# EAGLE design mood-badge (EAGLE 9.6.2)
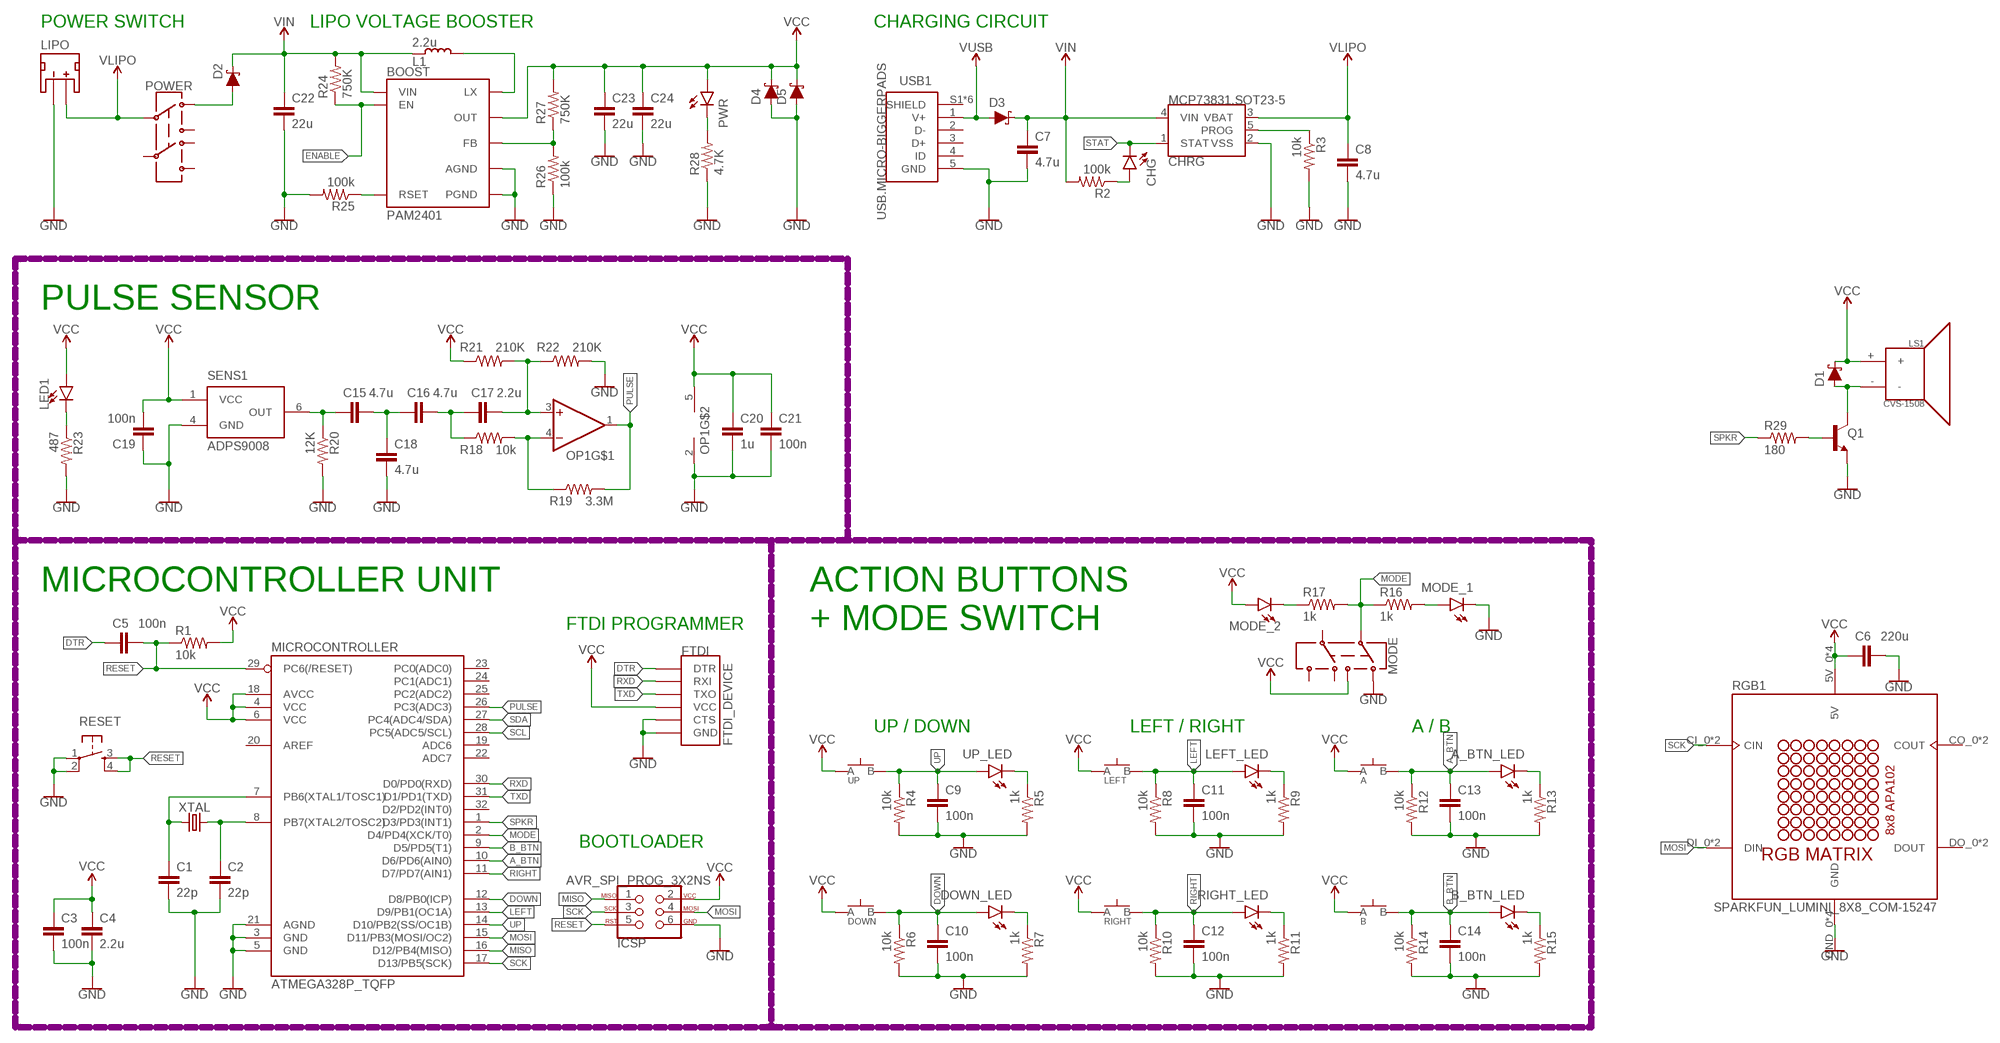
[diagram p0: schematic, sheet 1]

## Parts
A  SPST.KT11P4SM34LFS  [SPST.KT11P4SM34LFS]
A_BTN_LED  LED0603  [LED-0603]
B  SPST.KT11P4SM34LFS  [SPST.KT11P4SM34LFS]
B_BTN_LED  LED0603  [LED-0603]
BOOST  PAM2401  [MSOP8]
C1  22p  CAPACITOR0603  [C0603]
C2  22p  CAPACITOR0603  [C0603]
C3  100n  CAPACITOR0603  [C0603]
C4  2.2u  CAPACITOR0603  [C0603]
C5  100n  CAPACITOR0603  [C0603]
C6  220u  CAPACITOR1206  [C1206]
C7  4.7u  CAPACITOR0603  [C0603]
C8  4.7u  CAPACITOR0603  [C0603]
C9  100n  CAPACITOR0603  [C0603]
C10  100n  CAPACITOR0603  [C0603]
C11  100n  CAPACITOR0603  [C0603]
C12  100n  CAPACITOR0603  [C0603]
C13  100n  CAPACITOR0603  [C0603]
C14  100n  CAPACITOR0603  [C0603]
C15  4.7u  CAPACITOR0603  [C0603]
C16  4.7u  CAPACITOR0603  [C0603]
C17  2.2u  CAPACITOR0603  [C0603]
C18  4.7u  CAPACITOR0603  [C0603]
C19  100n  CAPACITOR0603  [C0603]
C20  1u  CAPACITOR0603  [C0603]
C21  100n  CAPACITOR0603  [C0603]
C22  22u  CAPACITOR0603  [C0603]
C23  22u  CAPACITOR0603  [C0603]
C24  22u  CAPACITOR0603  [C0603]
CHG  LED0603  [LED-0603]
CHRG  MCP73831.SOT23-5  [SOT23-5]
D1  SCHOTTKY-USC  [USC]
D2  SCHOTTKY-USC  [USC]
D3  SCHOTTKY-USC  [USC]
D4  SCHOTTKY-USC  [USC]
D5  SCHOTTKY-USC  [USC]
DOWN  SPST.KT11P4SM34LFS  [SPST.KT11P4SM34LFS]
DOWN_LED  LED0603  [LED-0603]
FTDI  FTDI_DEVICE  [FTDI_DEVICE]
ICSP  AVR_SPI_PROG_3X2NS  [2X3-NS]
L1  2.2u  INDUCTOR0603  [L0603]
LED1  LEDZ-BEND  [2-SMD.Z-BEND]
LEFT  SPST.KT11P4SM34LFS  [SPST.KT11P4SM34LFS]
LEFT_LED  LED0603  [LED-0603]
LIPO  JST_2MM_MALE  [JST-2-SMD]
LS1  CVS-1508  SPEAKERCVS-1508  [CVS-1508_PCBSPKR]
MICROCONTROLLER  ATMEGA328P_TQFP  [TQFP32-08]
MODE  SWITCH.JS202011JXQNUPWARDS  [SWITCH.00]
MODE_1  LED0603  [LED-0603]
MODE_2  LED0603  [LED-0603]
OP1  OP-SINGLEOT  [SOT23-5]
POWER  SWITCH.JS202011JXQNUPWARDS  [SWITCH.00]
PWR  LED0603  [LED-0603]
Q1  NPN-GENERIC  [SOT23-3]
R1  10k  RESISTOR0603  [R0603]
R2  100k  RESISTOR0603  [R0603]
R3  10k  RESISTOR0603  [R0603]
R4  10k  RESISTOR0603  [R0603]
R5  1k  RESISTOR0603  [R0603]
R6  10k  RESISTOR0603  [R0603]
R7  1k  RESISTOR0603  [R0603]
R8  10k  RESISTOR0603  [R0603]
R9  1k  RESISTOR0603  [R0603]
R10  10k  RESISTOR0603  [R0603]
R11  1k  RESISTOR0603  [R0603]
R12  10k  RESISTOR0603  [R0603]
R13  1k  RESISTOR0603  [R0603]
R14  10k  RESISTOR0603  [R0603]
R15  1k  RESISTOR0603  [R0603]
R16  1k  RESISTOR0603  [R0603]
R17  1k  RESISTOR0603  [R0603]
R18  10k  RESISTOR0603  [R0603]
R19  3.3M  RESISTOR0603  [R0603]
R20  12K  RESISTOR0603  [R0603]
R21  210K  RESISTOR0603  [R0603]
R22  210K  RESISTOR0603  [R0603]
R23  487  RESISTOR0603  [R0603]
R24  750K  RESISTOR0603  [R0603]
R25  100k  RESISTOR0603  [R0603]
R26  100k  RESISTOR0603  [R0603]
R27  750K  RESISTOR0603  [R0603]
R28  4.7K  RESISTOR0603  [R0603]
R29  180  RESISTOR0603  [R0603]
RESET  SPST-PTS830GG140  [BUTTON-GULLWING]
RGB1  SPARKFUN_LUMINI_8X8_COM-15247  [SPARKFUN_LUMINI_8X8_COM-15047]
RIGHT  SPST.KT11P4SM34LFS  [SPST.KT11P4SM34LFS]
RIGHT_LED  LED0603  [LED-0603]
SENS1  ADPS9008  [6-PIN.CHIPLED]
UP  SPST.KT11P4SM34LFS  [SPST.KT11P4SM34LFS]
UP_LED  LED0603  [LED-0603]
USB1  USB.MICRO-BIGGERPADS  [USB-MICRO-01.BIGGERPADS]
XTAL  CRYSTAL-CA-310  [CA-301]

## Nets
A_BTN: A.3(B) A.4(B) A_BTN_LED.A C13.1 MICROCONTROLLER.10(D6/PD6(AIN0)) R12.1
B_BTN: B.3(B) B.4(B) B_BTN_LED.A C14.1 MICROCONTROLLER.9(D5/PD5(T1)) R14.1
DOWN: C10.1 DOWN.3(B) DOWN.4(B) DOWN_LED.A MICROCONTROLLER.12(D8/PB0(ICP)) R6.1
DTR: C5.1 FTDI.DTR
ENABLE: BOOST.2(EN) R24.1
GND: BOOST.4(AGND) BOOST.8(PGND) C1.2 C2.2 C3.2 C4.2 C6.2 C7.2 C8.2 C9.2 C10.2 C11.2 C12.2 C13.2 C14.2 C18.2 C19.1 C20.2 C21.2 C22.2 C23.2 C24.2 CHRG.2(VSS) D4.+(A) D5.+(A) FTDI.CTS FTDI.GND ICSP.6 LIPO.1(-) MICROCONTROLLER.3(GND) MICROCONTROLLER.5(GND) MICROCONTROLLER.21(AGND) MODE.1 MODE_1.C OP1.2(V-) Q1.2(E) R3.2 R4.2 R5.2 R6.2 R7.2 R8.2 R9.2 R10.2 R11.2 R12.2 R13.2 R14.2 R15.2 R20.2 R22.2 R23.2 R25.2 R26.1 R28.1 RESET.1 RESET.2 RGB1.GND_0(GND) RGB1.GND_1(GND) RGB1.GND_2(GND) RGB1.GND_3(GND) SENS1.4(GND) USB1.5(GND)
LEFT: C11.1 LEFT.3(B) LEFT.4(B) LEFT_LED.A MICROCONTROLLER.13(D9/PB1(OC1A)) R8.1
MISO: ICSP.1 MICROCONTROLLER.16(D12/PB4(MISO))
MODE: MICROCONTROLLER.2(D4/PD4(XCK/T0)) MODE.2 R16.1 R17.2
MOSI: ICSP.4 MICROCONTROLLER.15(D11/PB3(MOSI/OC2)) RGB1.DI_0(DIN) RGB1.DI_1(DIN)
N$1: C1.1 MICROCONTROLLER.7(PB6(XTAL1/TOSC1)) XTAL.1
N$2: C2.1 MICROCONTROLLER.8(PB7(XTAL2/TOSC2)) XTAL.2
N$3: CHG.A R2.1
N$4: D2.+(A) POWER.1
N$5: D1.+(A) LS1.- Q1.3(C)
N$7: CHRG.5(PROG) R3.1
N$8: MODE_1.A R16.2
N$9: R5.1 UP_LED.C
N$11: DOWN_LED.C R7.1
N$13: LEFT_LED.C R9.1
N$15: R11.1 RIGHT_LED.C
N$17: A_BTN_LED.C R13.1
N$19: B_BTN_LED.C R15.1
N$20: C15.1 R20.1 SENS1.6(OUT)
N$21: MODE_2.C R17.1
N$23: C15.2 C16.1 C18.1
N$24: C16.2 C17.1 R18.1
N$25: C17.2 OP1.3(+IN) R21.2 R22.1
N$26: OP1.4(-IN) R18.2 R19.1
N$27: BOOST.6(RSET) R25.1
N$28: LED1.-(C) R23.1
N$29: BOOST.1(LX) L1.2
N$30: BOOST.5(FB) R26.2 R27.1
N$31: Q1.1(B) R29.2
N$32: PWR.C R28.2
PULSE: MICROCONTROLLER.26(PC3(ADC3)) OP1.1(OUT) R19.2
RESET: C5.2 ICSP.5 MICROCONTROLLER.29(PC6(/RESET)) R1.1 RESET.3 RESET.4
RIGHT: C12.1 MICROCONTROLLER.11(D7/PD7(AIN1)) R10.1 RIGHT.3(B) RIGHT.4(B) RIGHT_LED.A
RXD: FTDI.TXO(RXI) MICROCONTROLLER.30(D0/PD0(RXD))
SCK: ICSP.3 MICROCONTROLLER.17(D13/PB5(SCK)) RGB1.CI_0(CIN) RGB1.CI_1(CIN)
SCL: MICROCONTROLLER.28(PC5(ADC5/SCL))
SDA: MICROCONTROLLER.27(PC4(ADC4/SDA))
SPKR: MICROCONTROLLER.1(D3/PD3(INT1)) R29.1
STAT: CHG.C CHRG.1(STAT)
TXD: FTDI.RXI(TXO) MICROCONTROLLER.31(D1/PD1(TXD))
UP: C9.1 MICROCONTROLLER.14(D10/PB2(SS/OC1B)) R4.1 UP.3(B) UP.4(B) UP_LED.A
V_USB: D3.+(A) USB1.1(V+) ; supply symbol labelled VUSB
VCC: A.1(A) A.2(A) B.1(A) B.2(A) BOOST.7(OUT) C3.1 C4.1 C6.1 C19.2 C20.1 C21.1 C23.1 C24.1 D1.-(C) D4.-(C) D5.-(C) DOWN.1(A) DOWN.2(A) FTDI.VCC ICSP.2 LED1.+(A) LEFT.1(A) LEFT.2(A) LS1.+ MICROCONTROLLER.4(VCC) MICROCONTROLLER.6(VCC) MICROCONTROLLER.18(AVCC) MODE.3 MODE_2.A OP1.5(V+) PWR.A R1.2 R21.1 R27.2 RGB1.5V_0(5V) RGB1.5V_1(5V) RGB1.5V_2(5V) RGB1.5V_3(5V) RIGHT.1(A) RIGHT.2(A) SENS1.1(VCC) UP.1(A) UP.2(A)
VIN: BOOST.3(VIN) C7.1 C22.1 CHRG.4(VIN) D2.-(C) D3.-(C) L1.1 R2.2 R24.2
VLIPO: C8.1 CHRG.3(VBAT) LIPO.2(+) POWER.2
Unconnected: LIPO.NC1(PAD1) LIPO.NC2(PAD2) MICROCONTROLLER.19(ADC6) MICROCONTROLLER.20(AREF) MICROCONTROLLER.22(ADC7) MICROCONTROLLER.23(PC0(ADC0)) MICROCONTROLLER.24(PC1(ADC1)) MICROCONTROLLER.25(PC2(ADC2)) MICROCONTROLLER.32(D2/PD2(INT0)) MODE.5 MODE.6 MODE.7 POWER.3 POWER.5 POWER.6 POWER.7 RGB1.CO_0(COUT) RGB1.CO_1(COUT) RGB1.DO_0(DOUT) RGB1.DO_1(DOUT) USB1.2(D-) USB1.3(D+) USB1.4(ID) USB1.S1(SHIELD) USB1.S2(SHIELD) USB1.S3(SHIELD) USB1.S4(SHIELD) USB1.S5(SHIELD) USB1.S6(SHIELD)

## Notes on the sheet
- POWER SWITCH | LIPO VOLTAGE BOOSTER | CHARGING CIRCUIT
- PULSE SENSOR
- ACTION BUTTONS
  + MODE SWITCH
- MICROCONTROLLER UNIT
- FTDI PROGRAMMER
- UP / DOWN | LEFT / RIGHT | A / B
- BOOTLOADER

## Library data of the parts
A B DOWN LEFT RIGHT UP = LinnesLab-Switches:SPST.KT11P4SM34LFS: https://www.ckswitches.com/media/1468/kt.pdf
A_BTN_LED B_BTN_LED CHG DOWN_LED LED1 LEFT_LED MODE_1 MODE_2 PWR RIGHT_LED UP_LED = LinnesLab-LED:LED: LED (Generic) Standard schematic elements and footprints for 5mm, 3mm, 1206, and 0603 sized LEDs. Generic LEDs with no color specified. LTST-C190KGKT: arrow indicates cathode
BOOST = SparkFun-IC-Power:PAM2401: PAM2401 - Boost PMIC Specifications: Up to 1A output current 0.9V to 4.75V Input Range 2.5V to 5.0V Adjustable Output Voltage Datasheet <https://www.diodes.com/assets/Datasheets/PAM2401.pdf> (Diodes inc.); PROD_ID: IC-13769
C1-C24 = LinnesLab-Passives:CAPACITOR
CHRG = LinnesLab-Power:MCP73831
D1-D5 = LinnesLab-DiscreteSemi:SCHOTTKY: Schottky diode A Schottky diode is a semiconductor diode which has a low forward voltage drop and a very fast switching action. Example: Digi-Key Part Number: RB161MM-20CT-ND
FTDI = LinnesLab-Connectors:FTDI_DEVICE
ICSP = LinnesLab-Connectors:AVR_SPI_PROG_3X2: AVR ISP 6 Pin This is the reduced ISP connector for AVR programming. Common on Arduino. This footprint will take up less PCB space and can be used with a 10-pin to 6-pin adapter such as SKU: BOB-08508 **Special note about "TEST_POINT" package. The stop mask is on the top side, so if you want your programming test points to be on the bottom of your board, make sure to place this package on the bottom side of the board. This also ensure that the orientation to program from the bottom side will be correct. SparkFun Products: SparkFun ISP Pogo Adapter <https://www.sparkfun.com/products/11591> - NS Tiny AVR Programmer <https://www.sparkfun.com/products/11801> -PTH
L1 = LinnesLab-Passives:INDUCTOR
LIPO = LinnesLab-Connectors:JST_2MM_MALE: JST 2MM MALE RA CONNECTOR Two pin, compact surface mount connector. Commonly used as a battery input connection point. We really like the solid locking feeling and high current rating on these small connectors. We use these all the time as battery connectors. Mates to single-cell LiPo batteries. Here is the connector we sell at SparkFun: JST Right Angle Connector - White <https://www.sparkfun.com/products/8612> (PRT-08612) Datasheet <http://www.sparkfun.com/datasheets/Prototyping/Connectors/JST-Horizontal.pdf> It was used on these SparkFun products: SparkFun MOSFET Power Controller <https://www.sparkfun.com/products/11214> (PRT-11214) SparkFun Battery Babysitter - LiPo Battery Manager <https://www.sparkfun.com/products/13777> (PRT-13777) And many, many others that required a lipo battery connection.; PROD_ID: CONN-11443; SF_ID: PRT-08612
LS1 = SparkFun-Electromechanical:SPEAKER: Speaker Generic 2-terminal loudspeakers SparkFun Products Speaker - PCB Mount <https://www.sparkfun.com/products/11089> (COM-11089); PROD_ID: COM-14823
MICROCONTROLLER = LinnesLab-Microcontrollers:ATMEGA328P_TQFP: Popular 328P in QFP Storefront component: ATmega328 - TQFP <https://www.sparkfun.com/products/13448> (COM-13448) Datasheet <http://www.sparkfun.com/datasheets/Components/SMD/ATMega328.pdf> SparkFun Products SparkFun RedBoard - Programmed with Arduino <https://www.sparkfun.com/products/12757> (DEV-12757) Arduino Pro Mini 328 - 5V/16MHz <https://www.sparkfun.com/products/11113> (DEV-11113) Arduino Pro Mini 328 - 3.3V/8MHz <https://www.sparkfun.com/products/11114> (DEV-11114) SparkFun OpenLog <https://www.sparkfun.com/products/13712> (DEV-13712) SparkFun MicroView - OLED Arduino Module <https://www.sparkfun.com/products/12923> (DEV-12923) SparkFun Digital Sandbox <https://www.sparkfun.com/products/12651> (DEV-12651) SparkFun PicoBoard <https://www.sparkfun.com/products/11888> (WIG-11888) Arduino Fio <https://www.sparkfun.com/products/10116> (DEV-10116) LilyPad Arduino 328 Main Board <https://www.sparkfun.com/products/13342> (DEV-13342) SparkFun RedStick <https://www.sparkfun.com/products/13741> (DEV-13741) LilyPad MP3 <https://www.sparkfun.com/products/11013> (DEV-11013) LilyPad Arduino SimpleSnap <https://www.sparkfun.com/products/10941> (DEV-10941) SparkFun Stepoko <https://www.sparkfun.com/products/13899> (ROB-13899) SparkFun Geiger Counter <https://www.sparkfun.com/products/11345> (SEN-11345) SparkFun EL Sequencer <https://www.sparkfun.com/products/12781> (COM-12781) Arduino Pro 328 - 5V/16MHz <https://www.sparkfun.com/products/10915> (DEV-10915) CryptoCape <https://www.sparkfun.com/products/12773> (DEV-12773) SparkFun IR Thermometer Evaluation Board - MLX90614 <https://www.sparkfun.com/products/10740> (SEN-10740) SparkFun RedBot Mainboard <https://www.sparkfun.com/products/12097> (ROB-12097) Arduino Pro 328 - 3.3V/8MHz <https://www.sparkfun.com/products/10914> (DEV-10914) SparkFun Block for Intel® Edison - Arduino <https://www.sparkfun.com/products/13036> (DEV-13036) SparkFun Simon Says - Surface Mount Soldering Kit <https://www.sparkfun.com/products/10935> (KIT-10935) SparkFun 7-Segment Serial Display - Red <https://www.sparkfun.com/products/11441> (COM-11441) SparkFun 7-Segment Serial Display - White <https://www.sparkfun.com/products/11629> (COM-11629) SparkFun 7-Segment Serial Display - Yellow <https://www.sparkfun.com/products/11443> (COM-11443) SparkFun 7-Segment Serial Display - Kelly Green <https://www.sparkfun.com/products/11440> (COM-11440) SparkFun 7-Segment Serial Display - Blue <https://www.sparkfun.com/products/11442> (COM-11442) SparkFun OpenSegment Serial Display - 20mm (Blue) <https://www.sparkfun.com/products/11647> (COM-11647) SparkFun OpenSegment Serial Display - 20mm (Green) <https://www.sparkfun.com/products/11646> (COM-11646) SparkFun OpenSegment Serial Display - 20mm (White) <https://www.sparkfun.com/products/11648> (COM-11648) SparkFun OpenSegment Serial Display - 20mm (Red) <https://www.sparkfun.com/products/11644> (COM-11644) SparkFun OpenSegment Serial Display - 20mm (Yellow) <https://www.sparkfun.com/products/11645> (COM-11645) SparkFun OpenSegment Shield <https://www.sparkfun.com/products/13190> (DEV-13190); PROD_ID: IC-09069
MODE POWER = LinnesLab-Switches:SWITCH.JS202011JXQN: Manufacturer's Part Numer: JS202011JAQN for right angle throw JS202011JCQN for top side throw
OP1 = LinnesLab-AnalogIC:OP-SINGLE: Single Op Amp 2.7V to 6.0V Single Supply CMOS Source: http://ww1.microchip.com/downloads/en/DeviceDoc/21314g.pdf
Q1 = LinnesLab-DiscreteSemi:NPN
R1-R29 = LinnesLab-Passives:RESISTOR
RESET = LinnesLab-Switches:SPST-PTS830GG140
RGB1 = mood-badge-components:SPARKFUN_LUMINI_8X8_COM-15247: SparkFun LuMini LED Matrix - 8x8 (64 x APA102-2020) https://www.sparkfun.com/products/15047 This is the 8x8 SparkFun LuMini LED Matrix, packed with 64 individually addressable LEDs, each capable of producing 16 million colors, it provides you with a great way to add a square of light to just about anything, or even make a screen of a custom shape! LuMini is a miniaturized version of our Lumenati LED line but instead of utilizing 5mm by 5mm APA102 LEDs (APA102-5050), LuMini uses a 2mm by 2mm package (APA102-2020). This allows for incredibly tight pixel densities, and thus, a screen with less pixelation! The LuMini LED Matrix is powered and controlled using a few solder pads on the back of each board. These pads include 5V and ground, a set of pads for data in and clock input, and another set for data out and clock output. Since the matrix acts like a string of LEDs, the indexing (or numbering) of the LEDs moves from left to right, bottom to top of the board, on the LED facing side. The last handy feature we've equipped the LuMini LED Matrix with is four detachable mounting points that can be used to secure your ring to a surface/project or be broken off to make more complex designs. However if you want to break off the mounting holes from the board, multiple matrices can be soldered together to form a larger display! Note: In larger installations you may need to add a decoupling capacitor between power and ground to prevent voltage dips when turning on a whole bunch of LED’s simultaneously. We recommend using a 4.7µF capacitor which we sell in strips of 10.
SENS1 = LinnesLab-Sensors:ADPS9008
USB1 = LinnesLab-Connectors:USB.MICRO: DigiKey PN: 609-4613-1-ND
XTAL = LinnesLab-Clocks:CRYSTAL-CA-310

## Board
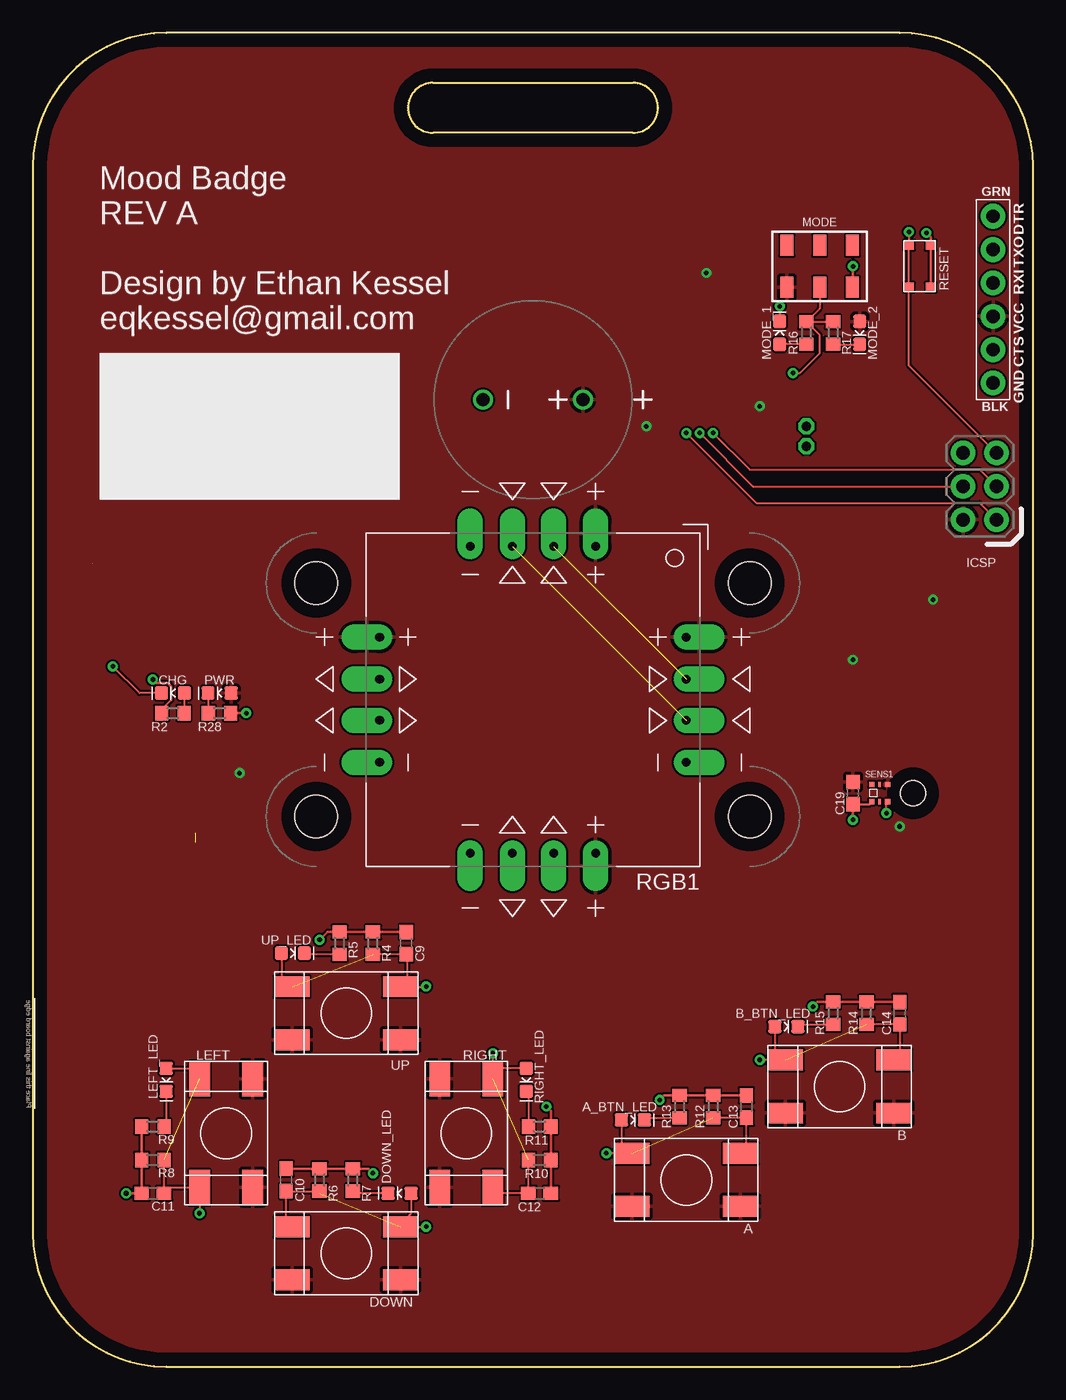
[diagram p1: board, top side]
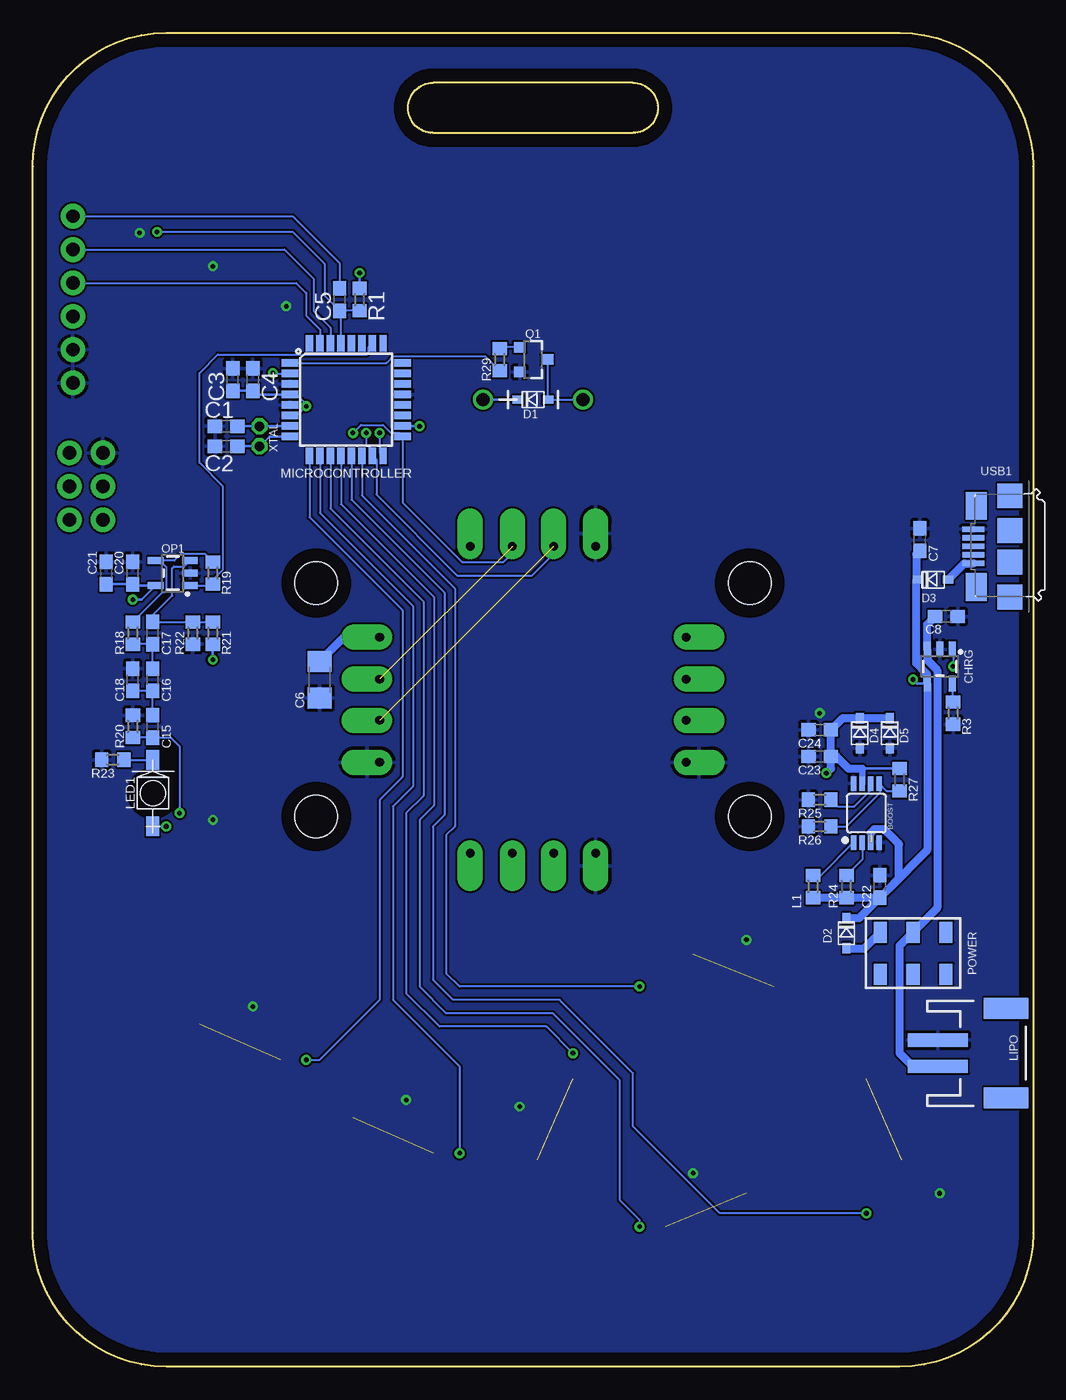
[diagram p2: board, bottom side, seen from below]

Size 76.2 x 101.6 mm. Coordinates in mm from the lower left corner, seen from the top.
Outline: 30.48,97.79 arc180 30.48,93.98 45.72,93.98 arc180 45.72,97.79 30.48,97.79
Outline: 0,10.16 arc90 10.16,0 66.04,0 arc90 76.2,10.16 76.2,91.44 arc90 66.04,101.6 10.16,101.6 arc90 0,91.44 0,10.16
Copper layers (1*16): Top 0.035mm / dielectric 1.5mm / Bottom 0.035mm
Design rules "default": minimum track width 6mil, minimum drill 0.35mm, track to track 6mil, track to pad 6mil, pad to pad 6mil, via to via 6mil, smd to smd 6mil, copper to edge 40mil, drill to drill 6mil, minimum pad ring 10mil, minimum via ring 8mil, stop-mask expansion 4mil, vias tented up to drill 0mil, thermal gap 10mil

### Footprints (pad centres in the part's own frame; a part is rotated, then mirrored left to right if it is on the bottom)
SPST.KT11P4SM34LFS = smd 2.665 x 1.59: 1 -4.128,2.02; 2 4.128,2.02; 3 -4.128,-2.02; 4 4.128,-2.02
LED-0603 = smd 1 x 1: A -0.877,0; C 0.877,0
MSOP8 = smd 0.4 x 1.1: 1 -0.975,-2.25; 2 -0.325,-2.25; 3 0.325,-2.25; 4 0.975,-2.25; 5 0.975,2.25; 6 0.325,2.25; 7 -0.325,2.25; 8 -0.975,2.25
C0603 = smd 1.1 x 1: 1 -0.85,0; 2 0.85,0
C1206 = smd 1.6 x 1.8: 1 -1.4,0; 2 1.4,0
SOT23-5 = smd 0.55 x 1.2: 1 -0.95,-1.3; 2 0,-1.3; 3 0.95,-1.3; 4 0.95,1.3; 5 -0.95,1.3
USC = smd 0.8 x 0.6: + -1.15,0; - 1.15,0
FTDI_DEVICE = drill 1.016 pad 1.88: CTS 3.81,0; DTR -6.35,0; GND 6.35,0; RXI -1.27,0; TXO -3.81,0; VCC 1.27,0
2X3-NS = drill 1.016 pad 1.88: 1 -2.54,-1.27; 2 -2.54,1.27; 3 0,-1.27; 4 0,1.27; 5 2.54,-1.27; 6 2.54,1.27
L0603 = smd 1 x 1.1: 1 -0.85,0; 2 0.85,0
2-SMD.Z-BEND = smd 1.5 x 1: + -2.525,0; - 2.525,0 | hole 1.9: 0,0
JST-2-SMD = smd 1 x 4.6: 1 -1,-3.7; 2 1,-3.7 | smd 1.6 x 3.4: NC1 -3.4,1.5; NC2 3.4,1.5
CVS-1508_PCBSPKR = drill 1: + 0,3.8; - 0,-3.8
TQFP32-08 = smd 1.27 x 0.559: 1 -4.293,2.8; 2 -4.293,2; 3 -4.293,1.2; 4 -4.293,0.4; 5 -4.293,-0.4; 6 -4.293,-1.2; 7 -4.293,-2; 8 -4.293,-2.8; 17 4.293,-2.8; 18 4.293,-2; 19 4.293,-1.2; 20 4.293,-0.4; 21 4.293,0.4; 22 4.293,1.2; 23 4.293,2; 24 4.293,2.8 | smd 0.559 x 1.27: 9 -2.8,-4.293; 10 -2,-4.293; 11 -1.2,-4.293; 12 -0.4,-4.293; 13 0.4,-4.293; 14 1.2,-4.293; 15 2,-4.293; 16 2.8,-4.293; 25 2.8,4.293; 26 2,4.293; 27 1.2,4.293; 28 0.4,4.293; 29 -0.4,4.293; 30 -1.2,4.293; 31 -2,4.293; 32 -2.8,4.293
SWITCH.00 = smd 1 x 1.6: 1 -2.5,1.6; 2 0,1.6; 3 2.5,1.6; 5 -2.5,-1.6; 6 0,-1.6; 7 2.5,-1.6
SOT23-3 = smd 0.8 x 0.9: 1 -0.95,-1; 2 0.95,-1; 3 0,1.1
R0603 = smd 1 x 1.1: 1 -0.85,0; 2 0.85,0
BUTTON-GULLWING = smd 0.7 x 0.75: 1 -1.6,0.825; 2 1.6,0.825; 3 -1.6,-0.825; 4 1.6,-0.825
SPARKFUN_LUMINI_8X8_COM-15047 = drill 0.65 pad 1.93 offset: 5V_0 -4.775,-11.684; 5V_1 -11.684,-4.775; 5V_2 11.684,-4.775; 5V_3 -4.775,11.684; CI_0 -1.575,-11.684; CI_1 -11.684,-1.575; CO_0 11.684,-1.575; CO_1 -1.575,11.684; DI_0 1.575,-11.684; DI_1 -11.684,1.575; DO_0 11.684,1.575; DO_1 1.575,11.684; GND_0 4.775,-11.684; GND_1 -11.684,4.775; GND_2 11.684,4.775; GND_3 4.775,11.684 | hole 3.251: -16.51,-8.89; 16.51,-8.89; 16.51,8.89; -16.51,8.89
6-PIN.CHIPLED = smd 0.4 x 0.4: 1 0.6,0.65; 3 -0.6,0.65; 4 -0.6,-0.65; 6 0.6,-0.65 | smd 0.2 x 0.4: 2 0,0.65; 5 0,-0.65
USB-MICRO-01.BIGGERPADS = smd 0.4 x 1.7: 1 -1.3,1.505; 2 -0.65,1.505; 3 0,1.505; 4 0.65,1.505; 5 1.3,1.505 | smd 1.9 x 1.9: S1 -3.85,-1.27; S2 -1.2,-1.27; S3 1.2,-1.27; S4 3.85,-1.27 | smd 2.1 x 1.6: S5 -3.1,1.28; S6 3.1,1.28
CA-301 = drill 0.711 octagon: 1 0,0; 2 1.524,0

### Placement (x,y rotation side)
A  49.78,14.22 180 top
A_BTN_LED  45.72,18.8 0 top
B  61.47,21.34 180 top
B_BTN_LED  57.4,25.91 0 top
BOOST  12.7,42.16 0 bottom
C1  61.47,71.63 180 bottom
C2  61.47,70.1 180 bottom
C3  60.96,75.18 90 bottom
C4  59.44,75.18 90 bottom
C5  52.83,81.28 270 bottom
C6  54.36,52.32 270 bottom
C7  8.64,62.99 90 bottom
C8  6.6,57.15 0 bottom
C9  28.45,32.26 90 top
C10  19.3,14.22 90 top
C11  9.14,13.21 180 top
C12  38.61,13.21 0 top
C13  54.36,19.81 90 top
C14  66.04,26.92 90 top
C15  67.06,48.77 90 bottom
C16  67.06,52.32 90 bottom
C17  67.06,55.88 90 bottom
C18  68.58,52.32 90 bottom
C19  62.48,43.69 90 top
C20  68.58,60.45 90 bottom
C21  70.61,60.45 90 bottom
C22  11.68,36.58 90 bottom
C23  16.26,46.48 180 bottom
C24  16.26,48.51 180 bottom
CHG  10.67,51.31 180 top
CHRG  7.11,53.34 180 bottom
D1  38.1,73.66 180 bottom
D2  14.22,33.02 90 bottom
D3  7.62,59.94 180 bottom
D4  13.21,48.26 90 bottom
D5  10.92,48.26 90 bottom
DOWN  23.88,8.64 180 top
DOWN_LED  27.94,13.21 180 top
FTDI  73.15,81.28 270 top
ICSP  72.14,67.06 90 top
L1  16.76,36.58 90 bottom
LED1  67.06,43.69 90 bottom
LEFT  14.73,17.78 270 top
LEFT_LED  10.16,21.84 270 top
LIPO  3.56,23.88 270 bottom
LS1  38.1,73.66 270 top
MICROCONTROLLER  52.32,73.66 0 bottom
MODE  59.94,83.82 180 top
MODE_1  56.9,78.74 90 top
MODE_2  62.99,78.74 270 top
OP1  65.53,60.45 90 bottom
POWER  9.14,31.5 0 bottom
PWR  14.22,51.31 180 top
Q1  38.1,76.71 270 bottom
R1  51.31,81.28 90 bottom
R2  10.67,49.78 180 top
R3  6.1,49.78 270 bottom
R4  25.91,32.26 90 top
R5  23.37,32.26 90 top
R6  21.84,14.22 90 top
R7  24.38,14.22 90 top
R8  9.14,15.75 180 top
R9  9.14,18.29 180 top
R10  38.61,15.75 0 top
R11  38.61,18.29 0 top
R12  51.82,19.81 90 top
R13  49.28,19.81 90 top
R14  63.5,26.92 90 top
R15  60.96,26.92 90 top
R16  58.93,78.74 270 top
R17  60.96,78.74 90 top
R18  68.58,55.88 90 bottom
R19  62.48,60.45 270 bottom
R20  68.58,48.77 90 bottom
R21  62.48,55.88 90 bottom
R22  64.01,55.88 270 bottom
R23  70.1,46.23 180 bottom
R24  14.22,36.58 270 bottom
R25  16.26,43.18 180 bottom
R26  16.26,41.15 0 bottom
R27  10.16,44.7 90 bottom
R28  14.22,49.78 180 top
R29  40.64,76.71 90 bottom
RESET  67.56,83.82 270 top
RGB1  38.1,50.8 180 top
RIGHT  33.02,17.78 90 top
RIGHT_LED  37.59,21.84 270 top
SENS1  64.52,43.69 0 top
UP  23.88,26.92 180 top
UP_LED  19.81,31.5 0 top
USB1  3.05,62.48 90 bottom
XTAL  58.93,71.63 270 bottom

### Tracks (layer width: path | path; a pad name or v marks a point on that pad's centre or on a via)
A_BTN  (via drill 0.35)  (1 unrouted)
  Top 0.152: A_BTN_LED.A 44.84,17.06 A.4 45.65,16.26 v43.69,16.26 | A.3 54.36,16.69 C13.1 R12.1
  Bottom 0.152: v43.69,16.26 43.69,22.86 48.77,27.94 48.77,42.67 47.24,44.2 47.24,57.95 54.32,65.04 MICROCONTROLLER.10
B_BTN  (via drill 0.35)  (1 unrouted)
  Top 0.152: B_BTN_LED.A 56.53,24.17 B.4 55.38,23.36 v55.37,23.37 | B.3 66.04,23.8 C14.1 R14.1
  Bottom 0.152: v55.37,23.37 54.36,23.37 49.78,27.94 49.78,43.18 48.04,44.92 48.04,57.62 55.12,64.71 MICROCONTROLLER.9
DOWN  (via drill 0.35)  (1 unrouted)
  Top 0.152: 18.93,10.91 DOWN.4 | C10.1 19.56,13.21 | 21.84,13.21 R6.1 C10.1 | DOWN_LED.A 28.82,11.72 DOWN.3 29.96,10.66 v29.97,10.67 | 19.56,11.1 DOWN.4 | C10.1 19.24,13.31 19.24,11.42 DOWN.4
  Bottom 0.152: v29.97,10.67 29.97,11.18 31.5,12.7 31.5,21.84 36.58,26.92 44.7,26.92 46.74,28.96 46.74,41.66 45.64,42.75 45.64,58.62 52.72,65.7 MICROCONTROLLER.12
DTR
  Bottom 0.152: FTDI.DTR 56.4,87.63 52.83,84.07 C5.1
ENABLE
  Bottom 0.152: BOOST.2 13.03,38.62 R24.1
GND  (via drill 0.35)
  Top 0.152: R7.2 24.59,15.03 | 24.59,15.03 24.3,14.73 | 24.55,15.07 24.59,15.03
  Top 0.203: C9.2 R4.2 R5.2 22.44,33.11 v21.84,32.51 | R9.2 R8.2 C11.2 v7.11,13.21 | C10.2 R6.2 24.55,15.07 | R7.2 25.57,15.07 v25.91,14.73 | C12.2 R10.2 R11.2 39.46,19.47 v39.12,19.81 | C13.2 R12.2 R13.2 48.09,20.66 v47.75,20.32 | C14.2 R14.2 R15.2 59.78,27.77 v59.44,27.43 | 63.97,43.09 SENS1.4 63.72,42.84 C19.1 v62.48,41.66 | R28.1 v16.26,49.78 | MODE.1 62.48,82.26 v62.48,83.82 | MODE_1.C v56.9,80.77 | RESET.2 RESET.1 68.39,86.04 v68.07,86.36
  pour Bottom: 0,0 0,101.6 76.2,101.6 76.2,0
LEFT  (via drill 0.35)  (1 unrouted)
  Top 0.152: R8.1 C11.1 9.99,13.65 LEFT.4 12.71,11.7 v12.7,11.68 | LEFT_LED.A 12.97,22.72 LEFT.3
  Bottom 0.152: v12.7,11.68 23.88,11.68 30.48,18.29 30.48,22.35 36.07,27.94 44.2,27.94 45.72,29.46 45.72,41.15 44.84,42.03 44.84,58.95 51.92,66.03 MICROCONTROLLER.13
MISO  (via drill 0.35)
  Top 0.152: ICSP.1 72.14,65.79 55.12,65.79 v49.78,71.12
  Bottom 0.152: v49.78,71.12 49.78,69.63 MICROCONTROLLER.16
MODE  (via drill 0.35)
  Top 0.152: MODE.2 59.94,80.61 R16.1 | R16.1 R17.2 | v57.91,75.69 58.42,75.69 59.94,77.22 59.94,78.57 R16.1
  Bottom 0.152: v57.91,75.69 57.88,75.66 MICROCONTROLLER.2
MOSI  (via drill 0.35)  (1 unrouted)
  Top 0.152: ICSP.4 54.86,67.06 v50.8,71.12
  Bottom 0.152: v50.8,71.12 50.8,70.28 50.32,69.81 MICROCONTROLLER.15 50.03,69.08 50.03,66.43 43.88,60.27 38.16,60.27 36.52,61.91 RGB1.DI_0
N$1
  Bottom 0.203: MICROCONTROLLER.7 58.9,71.66 XTAL.1 C1.1
N$2
  Bottom 0.203: MICROCONTROLLER.8 58.17,70.86 XTAL.2 C2.1
N$3
  Top 0.152: CHG.A 11.54,49.81 R2.1
N$4
  Bottom 0.152: 14.18,31.83 D2.+
  Bottom 0.61: D2.+ 12.87,31.87 POWER.1
N$5
  Bottom 0.152: LS1.- D1.+ 37,73.71 Q1.3
N$7
  Bottom 0.152: CHRG.5 6.16,50.69 R3.1
N$8
  Top 0.152: R16.2 56.92,77.89 MODE_1.A
N$9
  Top 0.152: R5.1 20.86,31.41 UP_LED.C
N$11
  Top 0.152: R7.1 24.64,13.21 DOWN_LED.C
N$13
  Top 0.152: LEFT_LED.C 10.16,18.29 R9.1
N$15
  Top 0.152: RIGHT_LED.C 37.76,20.8 R11.1
N$17
  Top 0.152: A_BTN_LED.C 46.76,18.96 R13.1
N$19
  Top 0.152: B_BTN_LED.C 58.45,26.07 R15.1
N$20  (via drill 0.35)
  Top 0.152: v65.02,42.16 65.02,42.95 SENS1.6
  Bottom 0.152: v65.02,42.16 65.02,47.24 65.7,47.92 C15.1 R20.1
N$21
  Top 0.152: R17.1 60.99,77.86 MODE_2.C
N$23
  Bottom 0.152: C15.2 C16.1 C18.1
N$24
  Bottom 0.152: C16.2 C17.1 R18.1
N$25
  Bottom 0.152: OP1.3 64.68,60.96 65.44,60.96 65.57,60.82 65.57,58.73 67.06,57.24 C17.2 R22.1 R21.2
N$26
  Bottom 0.152: R18.2 66.31,59 66.14,59 66,59.13 66,60.89 66.52,61.4 OP1.4 65.43,61.4 64.93,61.91 63.09,61.91 R19.1
N$27
  Bottom 0.152: BOOST.6 12.44,44.35 12.44,43.85 13.62,42.67 14.9,42.67 R25.1
N$28
  Bottom 0.152: R23.1 69.24,46.21 LED1.-
N$29
  Bottom 0.152: L1.2 16.16,37.43 BOOST.1
N$30
  Bottom 0.152: R26.2 14.22,41.15 11.68,43.69 11.68,44.37 BOOST.5 11.16,43.85 R27.1
N$31
  Bottom 0.152: Q1.1 40.54,77.66 R29.2
N$32
  Top 0.152: PWR.C 13.35,49.81 R28.2
PULSE
  Bottom 0.152: OP1.1 62.58,59.5 R19.2 62.48,59.93 61.7,60.71 61.7,67.06 63.5,68.85 63.5,75.69 62.1,77.09 50.75,77.09 50.62,77.22 50.62,77.66 MICROCONTROLLER.26
RESET  (via drill 0.35)
  Top 0.152: v66.74,86.44 RESET.3 RESET.4 66.74,76.26 ICSP.5
  Bottom 0.152: 51.25,80.37 R1.1 C5.2 | MICROCONTROLLER.29 52.72,80.32 C5.2 | C5.2 53.99,81.59 53.99,84.01 56.42,86.44 v66.74,86.44
RIGHT  (via drill 0.35)  (1 unrouted)
  Top 0.152: RIGHT.3 35.23,13.21 C12.1 R10.1 | RIGHT_LED.A 35.6,22.72 RIGHT.4 35.04,23.86 v35.05,23.88
  Bottom 0.152: v35.05,23.88 37.08,25.91 45.21,25.91 47.75,28.45 47.75,42.16 46.44,43.48 46.44,58.29 53.52,65.37 MICROCONTROLLER.11
RXD
  Bottom 0.152: FTDI.TXO 57.03,85.09 54.8,82.87 54.8,80.42 53.52,79.14 MICROCONTROLLER.30
SCK  (via drill 0.35)  (1 unrouted)
  Top 0.152: ICSP.3 72.14,68.33 54.61,68.33 v51.82,71.12
  Bottom 0.152: v51.82,71.12 51.21,71.73 49.53,71.73 48.93,71.12 48.29,71.12 MICROCONTROLLER.17 48.03,65.81 43.51,61.29 40.35,61.29 39.67,61.96 RGB1.CI_0
SPKR
  Bottom 0.152: MICROCONTROLLER.1 49.27,76.46 48.76,76.97 41.75,76.97 R29.1
STAT  (via drill 0.35)
  Top 0.152: CHG.C 8.13,51.31 v6.1,53.34
  Bottom 0.152: CHRG.1 6.1,54.57 v6.1,53.34
TXD
  Bottom 0.152: FTDI.RXI 56.13,82.55 55.37,81.79 55.37,80.04 54.32,79 MICROCONTROLLER.31
UP  (via drill 0.35)  (1 unrouted)
  Top 0.152: UP_LED.A 18.93,29.5 UP.4 | 26.48,31.41 R4.1 C9.1 28.51,31.41 28.51,29.2 UP.3 29.96,28.94 v29.97,28.96
  Bottom 0.152: v29.97,28.96 43.69,28.96 44.7,29.97 44.7,40.5 44.04,41.16 44.04,59.28 51.12,66.36 MICROCONTROLLER.14
V_USB  (1 unrouted)
  Bottom 0.152: USB1.1 5.23,61.18
  Bottom 0.61: D3.+ 5.24,61.18 USB1.1
VCC  (via drill 0.35)
  Bottom 0.152: R27.2 10.27,45.45 | LED1.+ 67.04,41.15
  Bottom 0.203: R27.2 13.03,45.55 | C21.1 C20.1 68.48,59.5 OP1.5 67.91,58.42 v68.58,58.42 | R21.1 v62.48,53.85 | C3.1 C4.1 59.16,74.06 MICROCONTROLLER.4 56.11,74.06 55.37,73.32 v55.37,73.15 56.06,72.46 MICROCONTROLLER.6 | D1.- LS1.+ | v51.31,83.31 R1.2 | MICROCONTROLLER.18 46.77,71.66 v46.74,71.63 | 67.04,41.15 v66.04,41.15
  Bottom 0.508: 13.03,45.55 BOOST.7
  Bottom 0.61: C23.1 C24.1 14.51,49.41 D4.- D5.- | C23.1 14.99,46.48 14.06,45.55 13.03,45.55 | v15.75,45.21 15.41,45.55 C23.1 | C6.1 52.51,55.58 RGB1.5V_1
  pour Top: 0,0 0,101.6 76.2,101.6 76.2,0
VIN  (via drill 0.35)  (1 unrouted)
  Top 0.152: R2.2 9.82,49.44
  Top 0.203: v9.14,52.34 9.42,52.06 10.31,52.06 10.54,51.83 10.54,50.79 9.82,50.06 R2.2
  Bottom 0.152: C22.1 | 8.9,59.81 8.97,59.74 | D3.- 8.64,60.08
  Bottom 0.203: CHRG.4 8.85,52.04 v9.14,52.34
  Bottom 0.61: L1.1 R24.2 C22.1 | D2.- 13.24,34.17 C22.1 | D3.- 8.9,59.81 | 8.9,59.81 8.9,53.58 8.06,52.74 CHRG.4 8.06,39.35 11.01,36.41 | C7.1 8.9,61.87 8.9,59.81 | 11.01,36.41 C22.1 | 12.38,40.66 12.11,40.92 11.34,40.92 10.22,39.8 10.22,37.2 11.01,36.41
VLIPO
  Bottom 0.61: C8.1 8.06,56.54 CHRG.3 8.06,53.81 7.3,53.05 7.3,34.94 POWER.2 10.16,32.08 10.16,23.88 9.16,22.88 LIPO.2

### Text on the board
tPlace: Mood Badge / REV A / / Design by Ethan Kessel / eqkessel@gmail.com